# EAGLE schematic RasPiTimePowerSWv.1.5 (EAGLE 8.3.2)
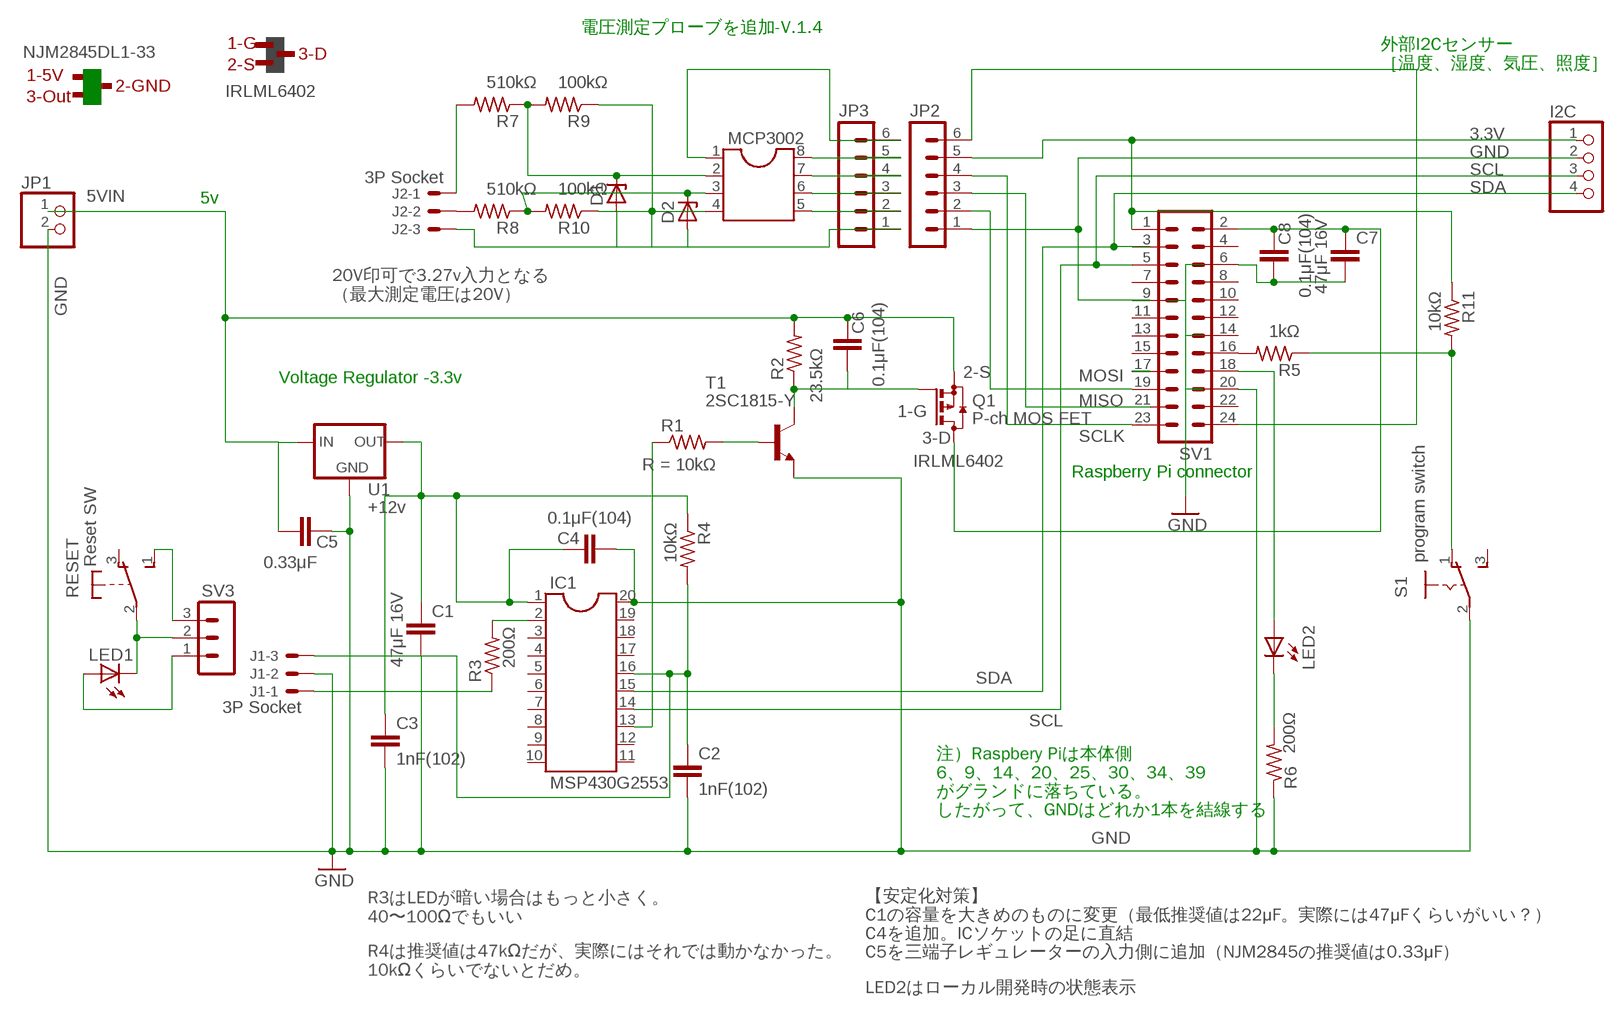
[diagram p0: schematic, sheet 1]

## Parts
C1  47μF 16V  C-EU075-042X103  [C075-042X103]
C2  1nF(102)  C-EU025-024X044  [C025-024X044]
C3  1nF(102)  C-EU025-024X044  [C025-024X044]
C4  0.1μF(104)  C-EU025-024X044  [C025-024X044]
C5  0.33μF  C-EU025-024X044  [C025-024X044]
C6  0.1μF(104)  C-EU025-024X044  [C025-024X044]
C7  47μF 16V  C-EU075-042X103  [C075-042X103]
C8  0.1μF(104)  C-EU025-024X044  [C025-024X044]
D1  ZENER-DIODEDO34-7  [DO34Z7]
D2  ZENER-DIODEDO34-7  [DO34Z7]
I2C  PINHD-1X4  [1X04]
IC1  MSP430G2553  DIL20S  [SOCKET-20]
J1  3P Socket  22-27-2031-03  [6410-03]
J2  3P Socket  22-27-2031-03  [6410-03]
JP1  PINHD-1X2  [1X02]
JP2  MA06-1  [MA06-1]
JP3  MA06-1  [MA06-1]
LED1  TLLG4400  [LED3MM]
LED2  TLLG4400  [LED3MM]
MCP3002  DIL8  [DIL08]
Q1  P-ch MOS FET  BSS84  [SOT23]
R1  R-US_MELF0102W  [MINI_MELF-0102W]
R2  R-US_MELF0102W  [MINI_MELF-0102W]
R3  R-US_MELF0102W  [MINI_MELF-0102W]
R4  10kΩ  R-US_MELF0102W  [MINI_MELF-0102W]
R5  R-US_MELF0102W  [MINI_MELF-0102W]
R6  R-US_MELF0102W  [MINI_MELF-0102W]
R7  R-US_MELF0102W  [MINI_MELF-0102W]
R8  R-US_MELF0102W  [MINI_MELF-0102W]
R9  R-US_MELF0102W  [MINI_MELF-0102W]
R10  R-US_MELF0102W  [MINI_MELF-0102W]
R11  10kΩ  R-US_MELF0102W  [MINI_MELF-0102W]
RESET  Reset SW  9450-1  [9450-1]
S1  program switch  255SB  [255SB]
SV1  MA12-2  [MA12-2]
SV3  MA03-1  [MA03-1]
T1  2SC1815-Y  2SC1815  [TO92-ECB]
U1  +12v  V_REG_78XX7812  [TO-252]

## Nets
3.3V: C1.1 C3.1 C4.1 I2C.1 IC1.1 JP2.5 R4.1 R11.1 SV1.1 U1.2(OUT)
5V: C7.1 C8.1 Q1.3(D) SV1.2
5VIN: C5.2 C6.1 JP1.1 Q1.2(S) R2.2 U1.1(IN)
GND: C1.2 C2.2 C3.2 C4.2 C5.1 I2C.2 IC1.20 J1.2 JP1.2 JP2.1 R6.1 S1.2(P) SV1.9 SV1.20 T1.E U1.3(GND)
MISO: JP2.3 SV1.21
MOSI: JP2.2 SV1.19
N$1: R1.2 T1.B
N$2: IC1.13 R1.1
N$3: R5.2 SV1.16
N$4: IC1.2 R3.2
N$5: R5.1 R11.2 S1.1(O)
N$6: C6.2 Q1.1(G) R2.1 T1.C
N$7: J2.2 R8.2
N$8: C7.2 C8.2 SV1.6
N$9: LED2.A SV1.18
N$10: LED2.K(C) R6.2
N$11: RESET.1(S) SV3.3
N$12: LED1.A SV3.1
N$13: SV1.17
N$14: JP2.6 SV1.24
N$15: D1.C MCP3002.2 R7.1 R9.2
N$16: D2.C MCP3002.3 R8.1 R10.2
N$18: J2.1 R7.2
N$19: JP3.6 MCP3002.1
N$20: D1.A D2.A J2.3 JP3.1 MCP3002.4 R9.1 R10.1
N$21: JP3.2 MCP3002.5
N$22: JP3.3 MCP3002.6
N$23: JP3.4 MCP3002.7
N$24: JP3.5 MCP3002.8
N$25: LED1.K(C) RESET.2(P) SV3.2
N$26: J1.1 R3.1
RESET: C2.1 IC1.16 J1.3 R4.2
SCL: I2C.3 IC1.14 SV1.5
SCLK: JP2.4 SV1.23
SDA: I2C.4 IC1.15 SV1.3
Unconnected: IC1.3 IC1.4 IC1.5 IC1.6 IC1.7 IC1.8 IC1.9 IC1.10 IC1.11 IC1.12 IC1.17 IC1.18 IC1.19 RESET.3(O) S1.3(S) SV1.4 SV1.7 SV1.8 SV1.10 SV1.11 SV1.12 SV1.13 SV1.14 SV1.15 SV1.22

## Notes on the sheet
- 電圧測定プローブを追加-V.1.4
- 1-G
- NJM2845DL1-33 | 3-D
- 外部I2Cセンサー
  ［温度、湿度、気圧、照度］
- 2-S
- 1-5V
- 2-GND
- IRLML6402
- 3-Out
- 5v
- 20V印可で3.27v入力となる
  （最大測定電圧は20V）
- 2-S
- Voltage Regulator -3.3v
- 1-G
- 3-D
- IRLML6402
- Raspberry Pi connector
- 注）Raspbery Piは本体側
  6、9、14、20、25、30、34、39
  がグランドに落ちている。
  したがって、GNDはどれか1本を結線する
- R3はLEDが暗い場合はもっと小さく。
  40〜100Ωでもいい
- 【安定化対策】
  C1の容量を大きめのものに変更（最低推奨値は22μF。実際には47μFくらいがいい？）
  C4を追加。ICソケットの足に直結
  C5を三端子レギュレーターの入力側に追加（NJM2845の推奨値は0.33μF）
- R4は推奨値は47kΩだが、実際にはそれでは動かなかった。
  10kΩくらいでないとだめ。
- LED2はローカル開発時の状態表示

## Library data of the parts
C1-C8 = resistor:C-EU: CAPACITOR, European symbol
D1 D2 = diode:ZENER-DIODE: Z-Diode
I2C = pinhead:PINHD-1X4: PIN HEADER
IC1 = ic-package:DIL20: Dual In Line / Socket
J1 J2 = con-molex:22-?-03: CONNECTOR wire to board 2.54 mm (.1 inch) pitch header; OC_FARNELL: unknown; OC_NEWARK: unknown
JP1 = pinhead:PINHD-1X2: PIN HEADER
JP2 JP3 = con-lstb:MA06-1: PIN HEADER; OC_FARNELL: unknown; OC_NEWARK: unknown
LED1 LED2 = led:TLLG4400: Low Current (2mA) LED 3 mm Tinted Diffused Package color GREEN Source: Data sheet <http://www.farnell.com/datasheets/391098.pdf>; MF: VISHAY SEMICONDUCTOR; OC_FARNELL: 1612435
MCP3002 = ic-package:DIL8: Dual In Line / Socket
Q1 = transistor-small-signal:BSS84: P-CHANNEL MOS FET
R1 = resistor:R-US_: RESISTOR, American symbol; R: 10kΩ
R2 = resistor:R-US_: RESISTOR, American symbol; 1K: 23.5kΩ
R3 R6 = resistor:R-US_: RESISTOR, American symbol; R: 200Ω
R4 R11 = resistor:R-US_: RESISTOR, American symbol
R5 = resistor:R-US_: RESISTOR, American symbol; 1K: 1kΩ
R7 R8 = resistor:R-US_: RESISTOR, American symbol; 1K: 510kΩ
R9 R10 = resistor:R-US_: RESISTOR, American symbol; 1K: 100kΩ
RESET = switch-misc:9450-1: MARQUARDT SWITCH
S1 = switch:255SB: SLIDING SWITCH Distributor Buerklin, 11G810
SV1 = con-lstb:MA12-2: PIN HEADER; OC_FARNELL: unknown; OC_NEWARK: unknown
SV3 = con-lstb:MA03-1: PIN HEADER; OC_FARNELL: unknown; OC_NEWARK: unknown
T1 = transistor:2SC1815: NPN EPITAXIAL TRANSISTOR Source: TOSHIBA .. 2SC1815 1.pdf
U1 = SparkFun-IC-Power:V_REG_78XX: Voltage Regulator Standard 78xx regulator. IGO (Input Ground Output). Spark Fun Electronics SKU : COM-00107; PROD_ID: VREG-12370